# Altium schematic sheet USB.SchDoc
size A3; SheetNumber: 3; SheetTotal: 5
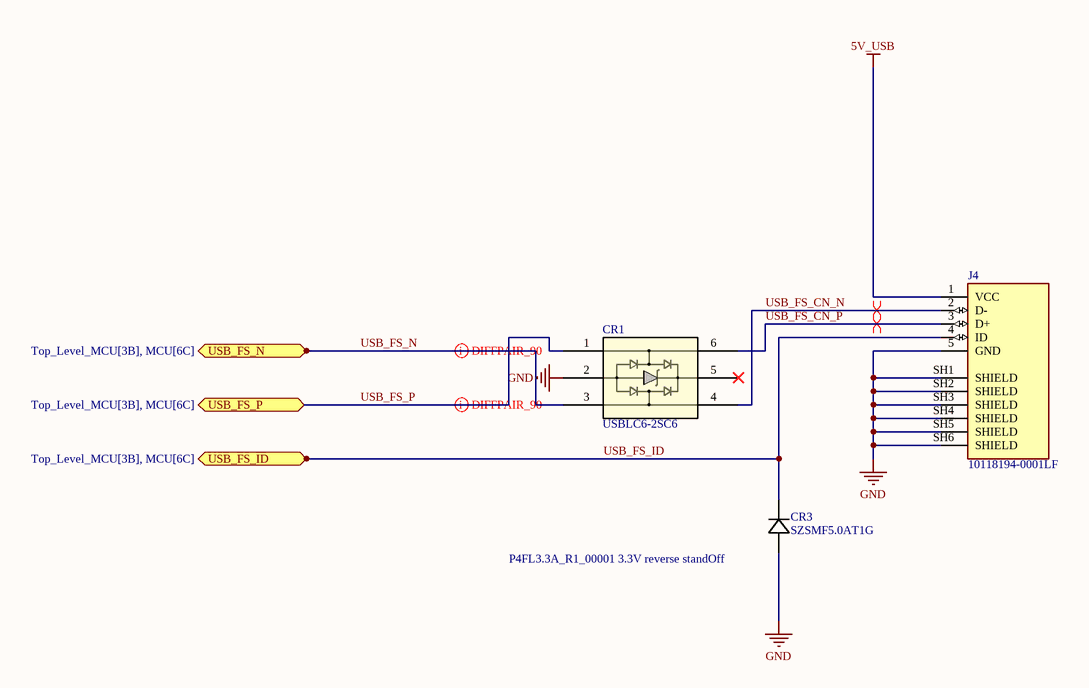
[diagram p0: USB.SchDoc]

## Parts
CR1  USBLC6-2SC6  [SOT23-6L_STM]
CR3  SZSMF5.0AT1G  [CR_SZSMF_LTF]
J4  10118194-0001LF  [AMPHENOL_10118194-0001LF]

## Ports
USB_FS_ID (bidir, see Top_Level_MCU[3B], MCU[6C]), USB_FS_N (bidir, see Top_Level_MCU[3B], MCU[6C]), USB_FS_P (bidir, see Top_Level_MCU[3B], MCU[6C])

## Nets
5V_USB: J4.1(VCC)
GND: CR1.2 CR3.2 J4.5(GND) J4.SH1(SHIELD) J4.SH2(SHIELD) J4.SH3(SHIELD) J4.SH4(SHIELD) J4.SH5(SHIELD) J4.SH6(SHIELD)
USB_FS_CN_N: CR1.4 J4.2(D-)
USB_FS_CN_P: CR1.6 J4.3(D+)
USB_FS_ID: CR3.1 J4.4(ID) ; port USB_FS_ID
USB_FS_N: CR1.3 ; port USB_FS_N
USB_FS_P: CR1.1 ; port USB_FS_P

Not connected (* = marked no-connect by the designer): CR1 5*

## Layout directives
differential pair: USB_FS_CN_N, USB_FS_CN_P, USB_FS_N, USB_FS_P

## Notes on the sheet
- (near CR3) P4FL3.3A_R1_00001 3.3V reverse standOff

## Library data of the parts
CR1 = USBLC6-2SC6: ESD Protection for USB 2.0 High Speed; Manufacturer_Name: STMicroelectronics; Copyright: Copyright (C) 2025 Ultra Librarian. All rights reserved.; Manufacturer_Part_Number: USBLC6-2SC6; RefDes: RefDes; Type: Type
CR3 = SZSMF5.0AT1G: Description; Manufacturer_Name: Littelfuse Inc; Copyright: Copyright (C) 2025 Ultra Librarian. All rights reserved.; Manufacturer_Part_Number: SZSMF5.0AT1G
J4 = 10118194-0001LF: Micro USB, Input Output Connectors, B TYPE RECEPTACLE with flange; MF: Amphenol ICC; SnapEDA_Link: https://www.snapeda.com/parts/10118194-0001LF/Amphenol+FCI/view-part/?ref=snap; Package: None; Value: *; MP: 10118194-0001LF; Check_prices: https://www.snapeda.com/parts/10118194-0001LF/Amphenol+FCI/view-part/?ref=eda